# Altium schematic sheet Project_Information.SchDoc: =project_title
size Tabloid; CompanyName: Luxonis Holding; Organization: Luxonis Holding; Address1: 1925 Harmony Park Drive; Address2: Westminster, CO; Address3: 80234; Address4: United States; SheetNumber: 1; SheetTotal: 13
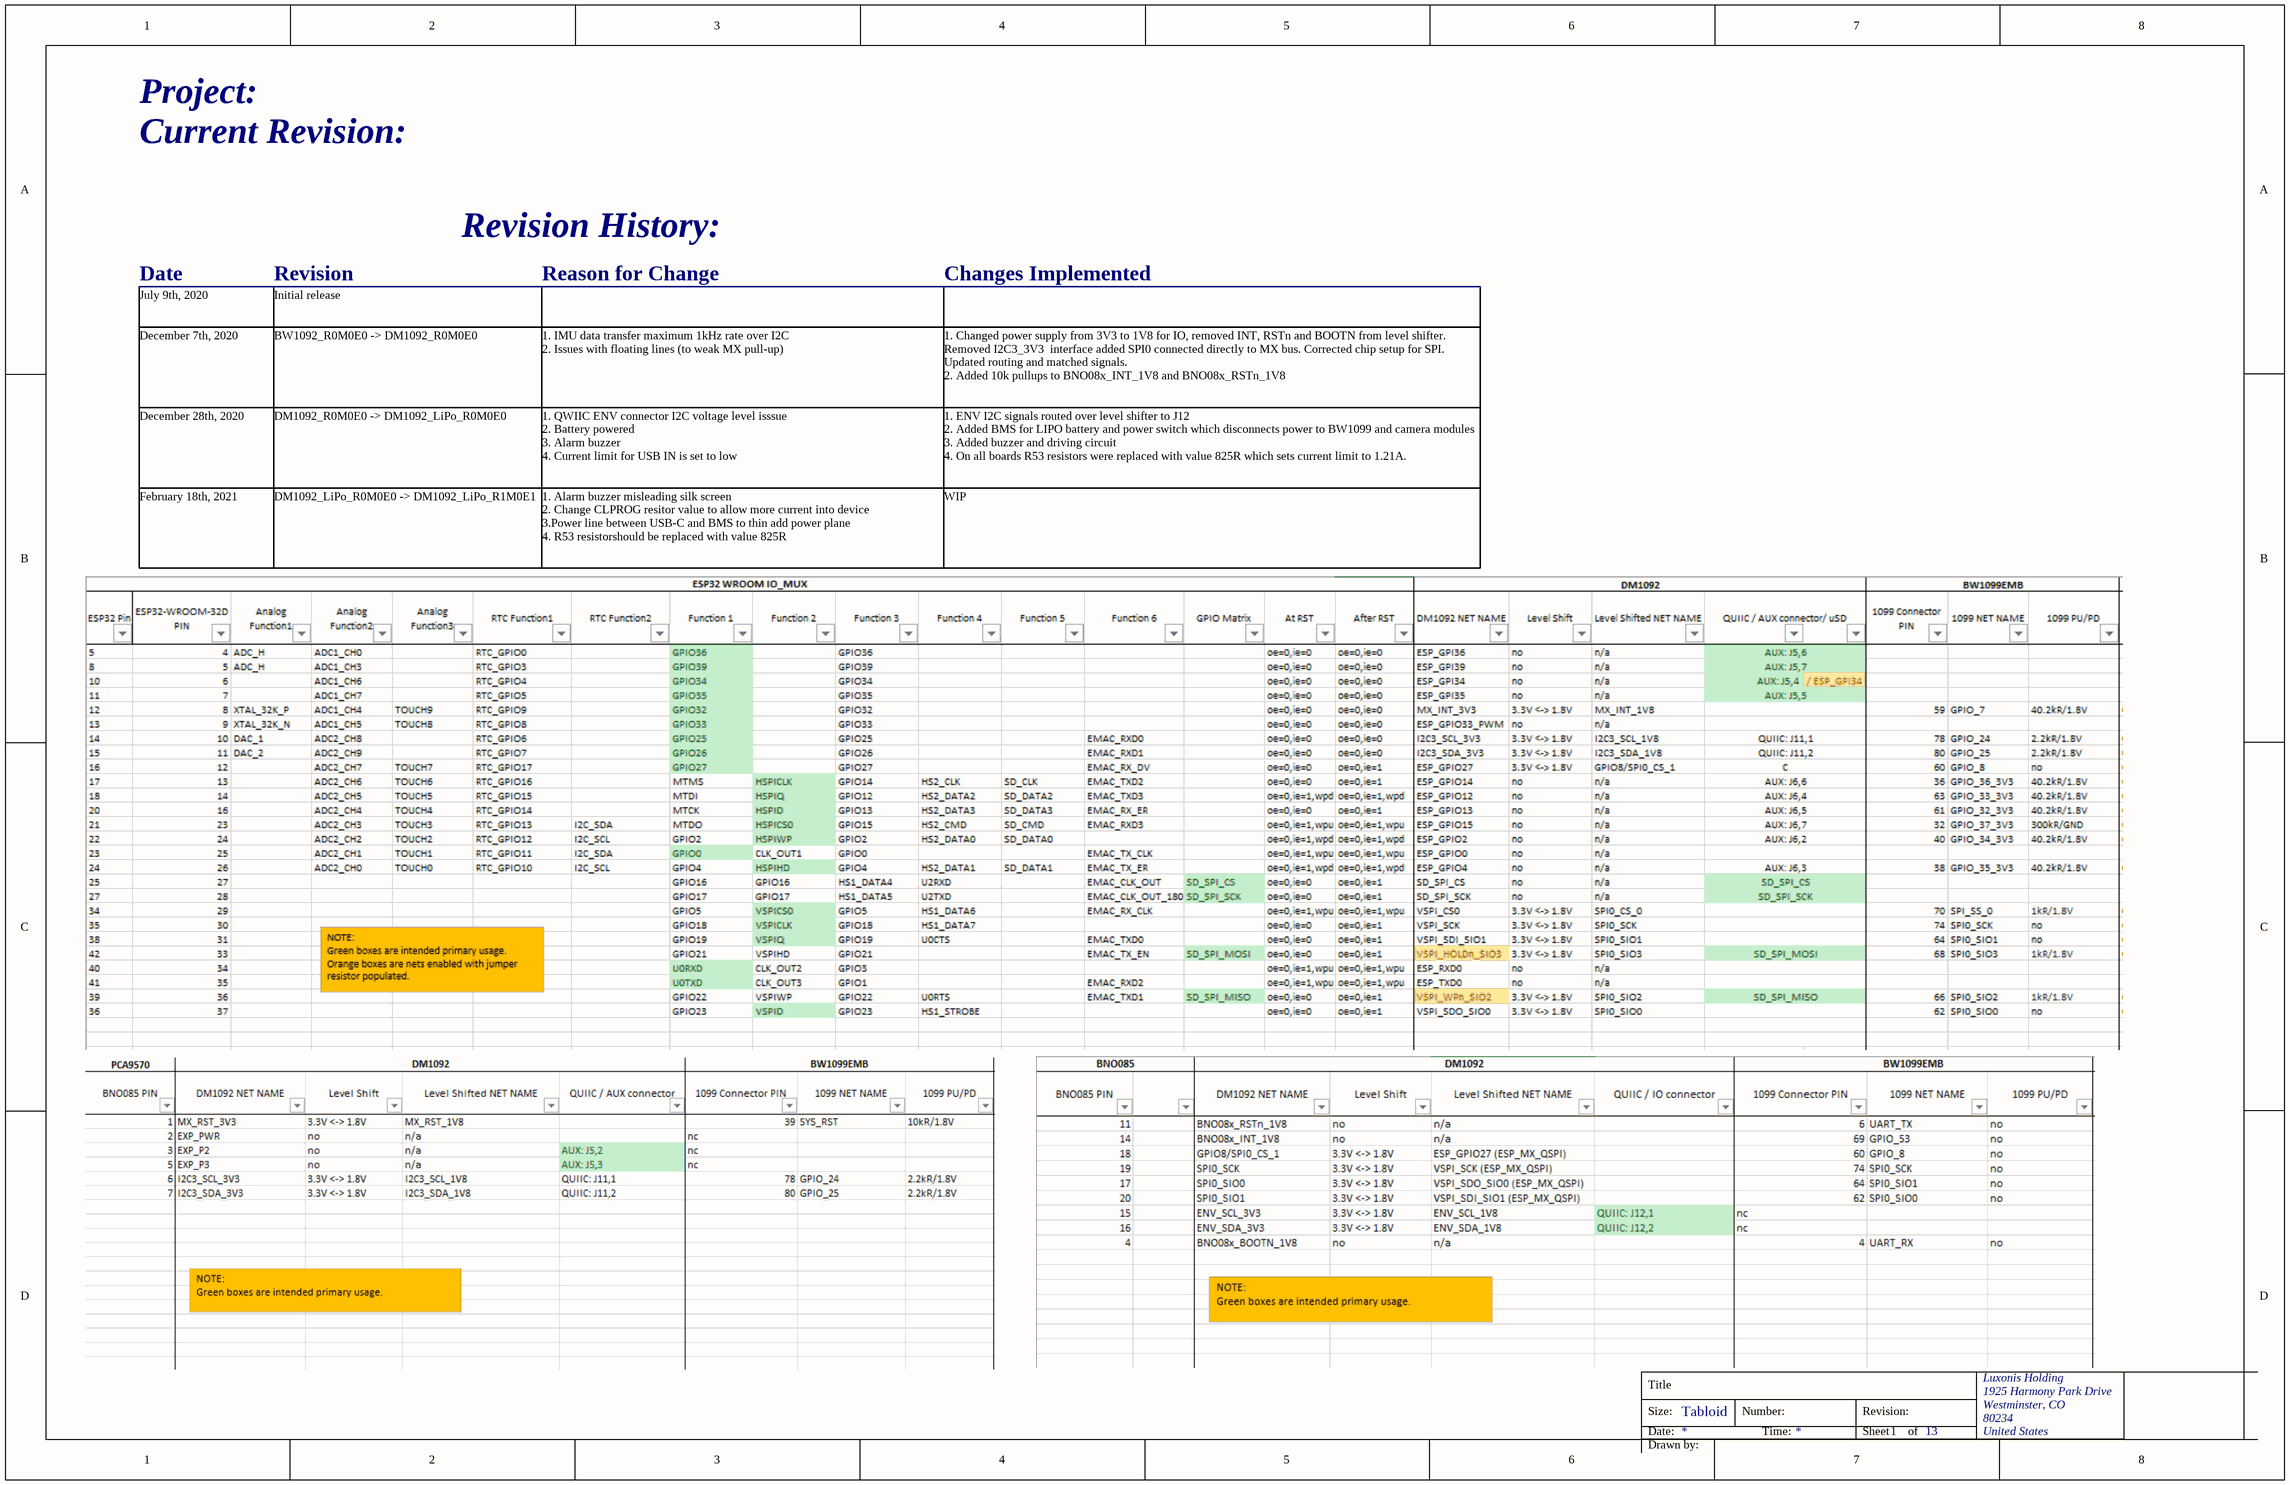
[diagram p0: Project_Information.SchDoc]

## Notes on the sheet
- Project:
- Current Revision:
- Date
- Revision
- Revision History:
- Reason for Change
- Changes Implemented
- July 9th, 2020
- Initial release
- December 7th, 2020
- BW1092_R0M0E0 -> DM1092_R0M0E0
- 1. IMU data transfer maximum 1kHz rate over I2C
  2. Issues with floating lines (to weak MX pull-up)
- 1. Changed power supply from 3V3 to 1V8 for IO, removed INT, RSTn and BOOTN from level shifter. Removed I2C3_3V3  interface added SPI0 connected directly to MX bus. Corrected chip setup for SPI. Updated routing and matched signals.
  2. Added 10k pullups to BNO08x_INT_1V8 and BNO08x_RSTn_1V8
- December 28th, 2020
- DM1092_R0M0E0 -> DM1092_LiPo_R0M0E0
- 1. QWIIC ENV connector I2C voltage level isssue
  2. Battery powered
  3. Alarm buzzer
  4. Current limit for USB IN is set to low
- 1. ENV I2C signals routed over level shifter to J12
  2. Added BMS for LIPO battery and power switch which disconnects power to BW1099 and camera modules
  3. Added buzzer and driving circuit
  4. On all boards R53 resistors were replaced with value 825R which sets current limit to 1.21A.
- February 18th, 2021
- DM1092_LiPo_R0M0E0 -> DM1092_LiPo_R1M0E1
- 1. Alarm buzzer misleading silk screen
  2. Change CLPROG resitor value to allow more current into device
  3.Power line between USB-C and BMS to thin add power plane
  4. R53 resistorshould be replaced with value 825R
- WIP
- Title
- Size:
- Date:
- Tabloid
- Number:
- Time:
- Revision:
- Sheet
- of
- Drawn by: